# EAGLE design picaxe28x1bb (EAGLE 7.1.0)
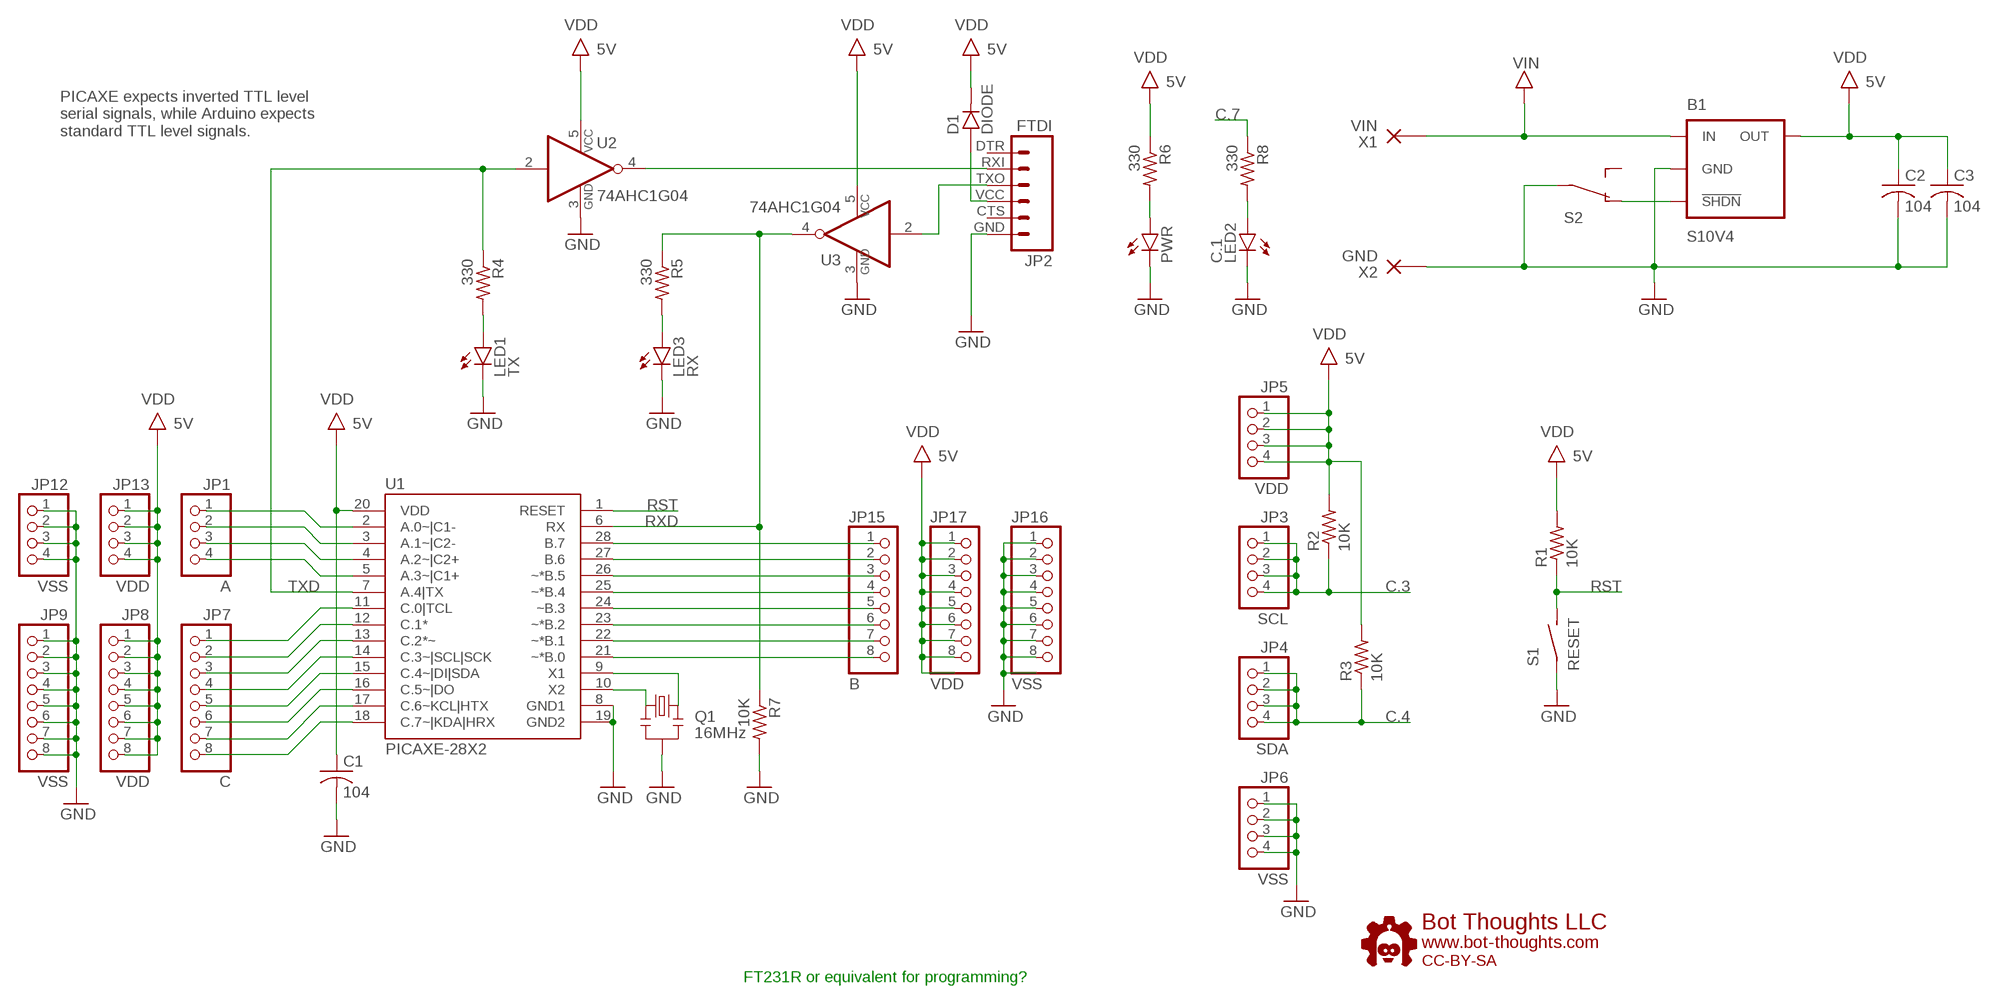
[diagram p0: schematic, sheet 1]

## Parts
B1  S10V4  POLOLU-S10V4  [POLOLU-S10V4]
C1  104  C-USC0603  [C0603]
C2  104  C-USC0603  [C0603]
C3  104  C-USC0603  [C0603]
D1  DIODE  DIODE_SOD123FL  [SOD123FL]
JP1  A  PINHD-1X04_2.54-S  [1X04-S]
JP2  FTDI  FTDI_BASICPTH  [FTDI_BASIC]
JP3  SCL  PINHD-1X04_2.54-S  [1X04-S]
JP4  SDA  PINHD-1X04_2.54-S  [1X04-S]
JP5  VDD  PINHD-1X04_2.54-S  [1X04-S]
JP6  VSS  PINHD-1X04_2.54-S  [1X04-S]
JP7  C  PINHD-1X08_2.54-S  [1X08-S]
JP8  VDD  PINHD-1X08_2.54-S  [1X08-S]
JP9  VSS  PINHD-1X08_2.54-S  [1X08-S]
JP12  VSS  PINHD-1X04_2.54-S  [1X04-S]
JP13  VDD  PINHD-1X04_2.54-S  [1X04-S]
JP15  B  PINHD-1X08_2.54-S  [1X08-S]
JP16  VSS  PINHD-1X08_2.54-S  [1X08-S]
JP17  VDD  PINHD-1X08_2.54-S  [1X08-S]
LED1  TX  LEDCHIPLED_0805  [CHIPLED_0805]
LED2  C.1  LEDCHIPLED_0805  [CHIPLED_0805]
LED3  RX  LEDCHIPLED_0805  [CHIPLED_0805]
PWR  LEDCHIPLED_0805  [CHIPLED_0805]
Q1  16MHz  RESONATOR_CSTCE_V_C  [CSTCE_V_C]
R1  10K  R-US_R0603  [R0603]
R2  10K  R-US_R0603  [R0603]
R3  10K  R-US_R0603  [R0603]
R4  330  R-US_R0603  [R0603]
R5  330  R-US_R0603  [R0603]
R6  330  R-US_R0603  [R0603]
R7  10K  R-US_R0603  [R0603]
R8  330  R-US_R0603  [R0603]
S1  RESET  SPST_3X4X2  [3X4X2TACT]
S2  SPDT_OS102011MAQN1  [OS102011MA1Q]
U1  PICAXE-28X2  [DIL28-3]
U2  74AHC1G04  74AHC1G04DBV  [SOT23-5]
U3  74AHC1G04  74AHC1G04DBV  [SOT23-5]
U$10  BTLOGO-LOGO-MD  [BTLOGOM]
X1  VIN  WIREPAD_18GA  [PAD_18GA]
X2  GND  WIREPAD_18GA  [PAD_18GA]

## Nets
A.0: JP1.1 U1.2(A.0~|C1-)
A.1: JP1.2 U1.3(A.1~|C2-)
A.2: JP1.3 U1.4(A.2~|C2+)
A.3: JP1.4 U1.5(A.3~|C1+)
B.0: JP15.8 U1.21(~*B.0)
B.1: JP15.7 U1.22(~*B.1)
B.2: JP15.6 U1.23(~*B.2)
B.3: JP15.5 U1.24(~B.3)
B.4: JP15.4 U1.25(~*B.4)
B.5: JP15.3 U1.26(~*B.5)
B.6: JP15.2 U1.27(B.6)
B.7: JP15.1 U1.28(B.7)
C.0: JP7.1 U1.11(C.0|TCL)
C.1: JP7.2 U1.12(C.1*)
C.2: JP7.3 U1.13(C.2*~)
C.3: JP3.1 JP3.2 JP3.3 JP3.4 JP7.4 R2.1 U1.14(C.3~|SCL|SCK)
C.4: JP4.1 JP4.2 JP4.3 JP4.4 JP7.5 R3.1 U1.15(C.4~|DI|SDA)
C.5: JP7.6 U1.16(C.5~|DO)
C.6: JP7.7 U1.17(C.6~KCL|HTX)
C.7: JP7.8 R8.1 U1.18(C.7~|KDA|HRX)
EN: B1.!SHDN S2.P$1(O1)
GND: B1.GND C1.2 C2.2 C3.2 JP2.GND JP6.1 JP6.2 JP6.3 JP6.4 JP9.1 JP9.2 JP9.3 JP9.4 JP9.5 JP9.6 JP9.7 JP9.8 JP12.1 JP12.2 JP12.3 JP12.4 JP16.1 JP16.2 JP16.3 JP16.4 JP16.5 JP16.6 JP16.7 JP16.8 LED1.C LED2.C LED3.C PWR.C Q1.GND R7.2 S1.P$1(P) S2.P$2(P) U1.8(GND1) U1.19(GND2) U2.3(GND) U3.3(GND) X2.P$1(P)
N$1: LED2.A R8.2
N$2: PWR.A R6.2
N$3: D1.A JP2.VCC
N$5: LED1.A R4.2
N$7: LED3.A R5.2
N$15: Q1.X2 U1.10(X2)
N$16: Q1.X1 U1.9(X1)
RST: R1.1 S1.P$2(S) U1.1(RESET)
RXD: R5.1 R7.1 U1.6(RX) U3.4(O)
RXI: JP2.RXI U2.4(O)
TXD: R4.1 U1.7(A.4|TX) U2.2(I)
TXO: JP2.TXO U3.2(I)
VDD: B1.VOUT(OUT) C1.1 C2.1 C3.1 D1.C JP5.1 JP5.2 JP5.3 JP5.4 JP8.1 JP8.2 JP8.3 JP8.4 JP8.5 JP8.6 JP8.7 JP8.8 JP13.1 JP13.2 JP13.3 JP13.4 JP17.1 JP17.2 JP17.3 JP17.4 JP17.5 JP17.6 JP17.7 JP17.8 R1.2 R2.2 R3.2 R6.1 U1.20(VDD) U2.5(VCC) U3.5(VCC) ; supply symbol labelled 5V
VIN: B1.VIN(IN) X1.P$1(P)
Unconnected: JP2.CTS JP2.DTR S2.P$3(O2)

## Notes on the sheet
- PICAXE expects inverted TTL level
  serial signals, while Arduino expects
  standard TTL level signals.
- FT231R or equivalent for programming?

## Library data of the parts
B1 = bt_regulator:POLOLU-S10V4: Pololu 5V Step-up, Step-down Switching Regulator This switching regulator uses the SEPIC topology to produce 5 V from input voltages between 2.5 V and 18 V. The wide input range coupled with its ability to convert both higher and lower input voltages makes it useful for applications where the power supply voltage can vary greatly, as with batteries that start above but discharge below 5 V. The compact (0.4″ × 0.575″) module can supply over 400 mA in typical applications. product link <https://www.pololu.com/product/2121>
C1-C3 = rcl:C-US: CAPACITOR, American symbol
D1 = bt_diode:DIODE: Diode Collection of generic diodes in various packages
JP1 JP3-JP6 JP12 JP13 = pinhead-2:PINHD-1X04: PIN HEADER
JP2 = SparkFun-Connectors:FTDI_BASIC: FTDI Basic header with labels
JP7-JP9 JP15-JP17 = pinhead-2:PINHD-1X08: PIN HEADER
LED1-LED3 PWR = bt_opto:LED: LED Various packages
Q1 = bt_crystal:RESONATOR: Crystal Resonator, 3-pin
R1-R8 = resistor:R-US_: RESISTOR, American symbol
S1 = bt_electromech:SPST: SPST SWITCH
S2 = bt_electromech:SPDT: MARQUARDT SWITCH
U1 = bt_pic:PICAXE-28X2: PICAXE 28 pin BASIC microcontroller chip PICAXE is a neat entry-level microcontroller system that is relatively cheap to get started with. The chip is programmed with a simple serial connection and the BASIC development environment is free! PICAXE has some excellent educational applications and support, and is a great entryway into more complicated embedded systems. If you’re look for a place to start with microcontrollers, PICAXE is a great way to go! datasheet.pdf <http://www.rev-ed.co.uk/docs/picaxe_manual1.pdf>
U2 U3 = 74xx-little-us:74*1G04: INVERTER Gate
U$10 = bt:BTLOGO: Bot Thoughts Logo
X1 X2 = bt_electromech:WIREPAD: PIN PAD (PINPAD) Generic pin pad connector

## Board
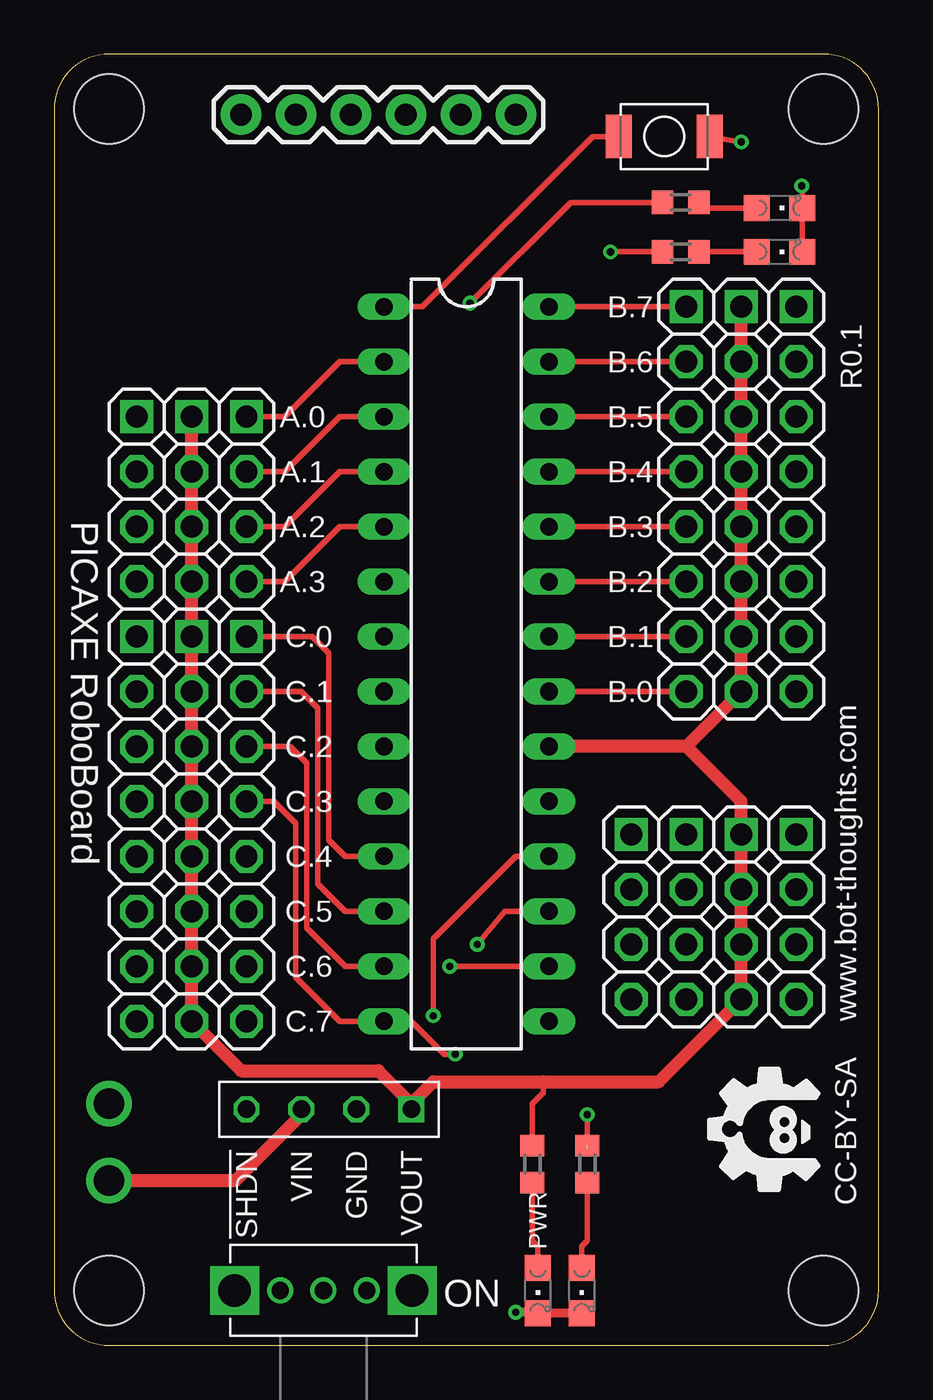
[diagram p1: board, top side]
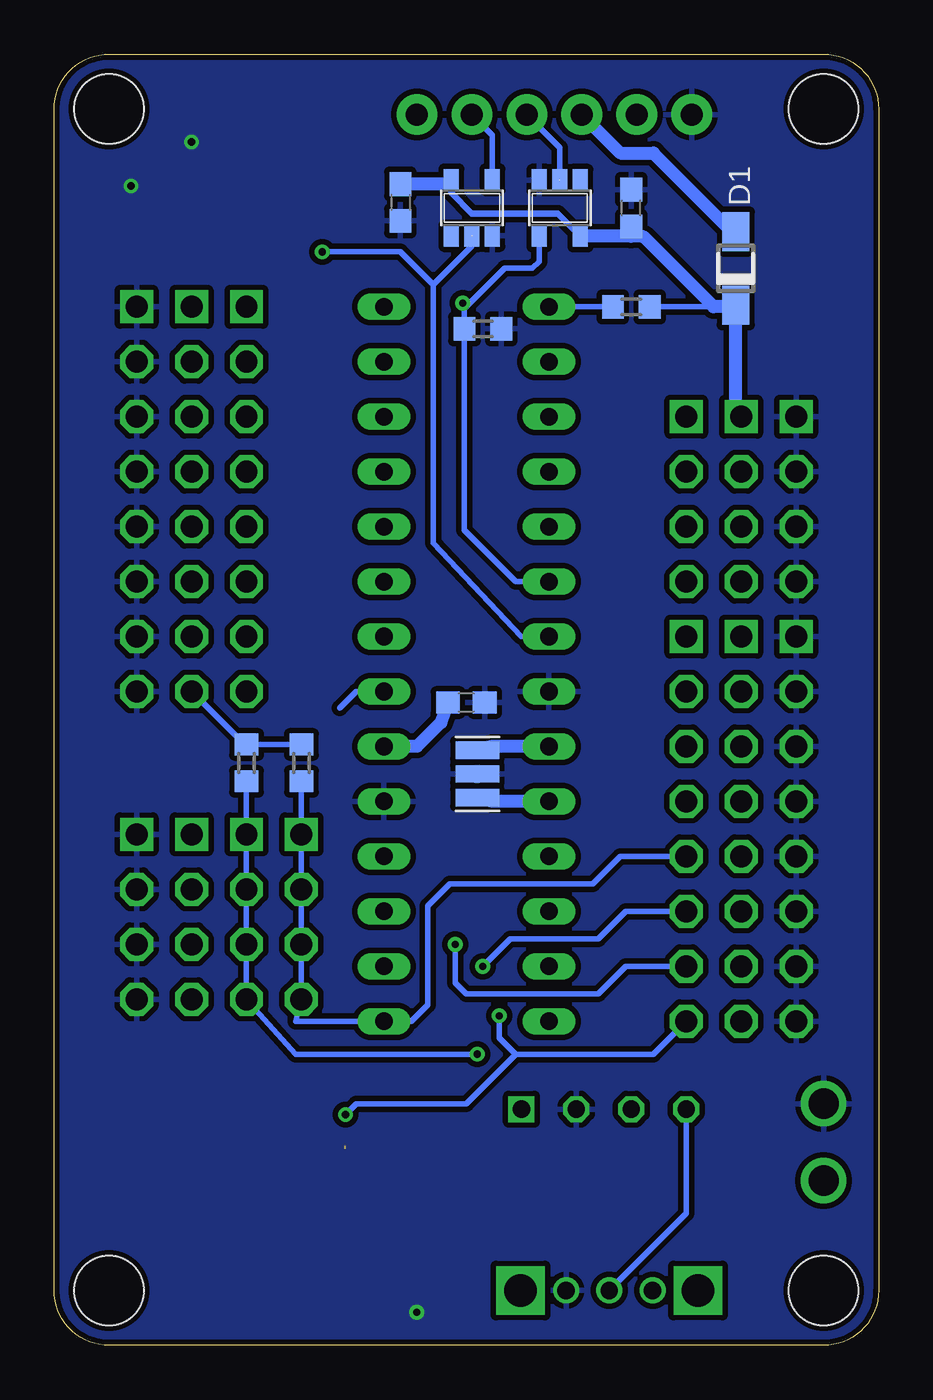
[diagram p2: board, bottom side, seen from below]

Size 38.1 x 59.69 mm. Coordinates in mm from the lower left corner, seen from the top.
Outline: 35.56,59.69 2.54,59.69 arc90 0,57.15 0,2.54 arc90 2.54,0 35.56,0 arc90 38.1,2.54 38.1,57.15 arc90 35.56,59.69
Copper layers (1*16): Top 0.0356mm / dielectric 1.5011mm / Bottom 0.0356mm
Design rules "LaenPCBOrder": minimum track width 6mil, minimum drill 13mil, track to track 10mil, track to pad 10mil, pad to pad 10mil, via to via 10mil, smd to smd 8mil, copper to edge 10mil, drill to drill 10mil, minimum pad ring 7mil, minimum via ring 7mil, stop-mask expansion 3mil, vias tented up to drill 20mil, thermal gap 10mil
Holes 3.2 mm at 2.54,57.15 35.56,57.15 35.56,2.54 2.54,2.54

### Footprints (pad centres in the part's own frame; a part is rotated, then mirrored left to right if it is on the bottom)
POLOLU-S10V4 = drill 0.8 octagon: !SHDN 3.81,0; GND -1.27,0; VIN 1.27,0 | drill 0.8 square: VOUT -3.81,0
C0603 = smd 1.1 x 1: 1 -0.85,0; 2 0.85,0
SOD123FL = smd 1.8 x 1.25: A 1.7,0; C -1.7,0
1X04-S = drill 1.016 square: 1 -3.81,0 | drill 1.016 octagon: 2 -1.27,0; 3 1.27,0; 4 3.81,0
FTDI_BASIC = drill 1.016 pad 1.88: CTS 10.16,0; DTR 0,0; GND 12.7,0; RXI 2.54,0; TXO 5.08,0; VCC 7.62,0
1X08-S = drill 1.016 square: 1 -8.89,0 | drill 1.016 octagon: 2 -6.35,0; 3 -3.81,0; 4 -1.27,0; 5 1.27,0; 6 3.81,0; 7 6.35,0; 8 8.89,0
CHIPLED_0805 = smd 1.2 x 1.2: A 0,-1.05; C 0,1.05
CSTCE_V_C = smd 0.8 x 2: GND 0,0; X1 -1.1,0; X2 1.1,0
R0603 = smd 1 x 1.1: 1 -0.85,0; 2 0.85,0
3X4X2TACT = smd 1.2 x 2: P$1 -2.1,0; P$2 2.1,0
OS102011MA1Q = drill 1.5 square: G1 -4.1,0; G2 4.1,0 | drill 0.8: P$1 0,0; P$2 2,0; P$3 -2,0
DIL28-3 = drill 0.813 long: 1 -16.51,-3.81; 2 -13.97,-3.81; 3 -11.43,-3.81; 4 -8.89,-3.81; 5 -6.35,-3.81; 6 -3.81,-3.81; 7 -1.27,-3.81; 8 1.27,-3.81; 9 3.81,-3.81; 10 6.35,-3.81; 11 8.89,-3.81; 12 11.43,-3.81; 13 13.97,-3.81; 14 16.51,-3.81; 15 16.51,3.81; 16 13.97,3.81; 17 11.43,3.81; 18 8.89,3.81; 19 6.35,3.81; 20 3.81,3.81; 21 1.27,3.81; 22 -1.27,3.81; 23 -3.81,3.81; 24 -6.35,3.81; 25 -8.89,3.81; 26 -11.43,3.81; 27 -13.97,3.81; 28 -16.51,3.81
SOT23-5 = smd 0.69 x 0.99: 1 -0.95,-1.29; 2 0,-1.29; 3 0.95,-1.29; 4 0.95,1.3; 5 -0.95,1.3
PAD_18GA = drill 1.4: P$1 0,0

### Placement (x,y rotation side)
B1  12.7,10.92 180 top
C1  19.05,29.72 0 bottom
C2  22.1,52.83 270 bottom
C3  11.43,52.58 90 bottom
D1  6.6,49.78 90 bottom
JP1  8.89,39.12 270 top
JP2  21.34,56.9 180 top
JP3  29.21,19.81 270 top
JP4  26.67,19.81 270 top
JP5  31.75,19.81 270 top
JP6  34.29,19.81 270 top
JP7  8.89,23.88 270 top
JP8  6.35,23.88 270 top
JP9  3.81,23.88 270 top
JP12  3.81,39.12 270 top
JP13  6.35,39.12 270 top
JP15  29.21,39.12 270 top
JP16  34.29,39.12 270 top
JP17  31.75,39.12 270 top
LED1  33.53,50.55 270 top
LED2  24.38,2.54 180 top
LED3  33.53,52.58 270 top
PWR  22.35,2.54 180 top
Q1  18.54,26.42 270 bottom
R1  11.43,48.01 0 bottom
R2  29.21,26.92 90 bottom
R3  26.67,26.92 90 bottom
R4  28.96,50.55 0 top
R5  28.96,52.83 0 top
R6  22.1,8.38 270 top
R7  18.29,46.99 0 bottom
R8  24.64,8.38 270 top
S1  28.19,55.88 180 top
S2  12.45,2.54 0 top
U1  19.05,31.5 270 top
U2  18.8,52.58 0 bottom
U3  14.73,52.58 180 bottom
U$10  35.56,9.91 90 top
X1  2.54,7.62 0 top
X2  2.54,11.18 0 top

### Tracks (layer width: path | path; a pad name or v marks a point on that pad's centre or on a via)
A.0
  Top 0.254: U1.2 13.21,45.47 10.67,42.93 JP1.1
A.1
  Top 0.254: U1.3 13.21,42.93 10.67,40.39 JP1.2
A.2
  Top 0.254: U1.4 13.21,40.39 10.67,37.85 JP1.3
A.3
  Top 0.254: U1.5 13.21,37.85 10.67,35.31 JP1.4
B.0
  Top 0.254: JP15.8 U1.21
  Bottom 0.254: U1.21 24.13,30.23 24.89,29.46
B.1
  Top 0.254: JP15.7 U1.22
B.2
  Top 0.254: JP15.6 U1.23
B.3
  Top 0.254: JP15.5 U1.24
B.4
  Top 0.254: JP15.4 U1.25
B.5
  Top 0.254: JP15.3 U1.26
B.6
  Top 0.254: JP15.2 U1.27
B.7
  Top 0.254: JP15.1 U1.28
C.0
  Top 0.254: JP7.1 11.94,32.77 12.7,32 12.7,23.37 13.46,22.61 U1.11
C.1
  Top 0.254: JP7.2 11.43,30.23 12.19,29.46 12.19,21.34 13.46,20.07 U1.12
C.2
  Top 0.254: JP7.3 10.92,27.69 11.68,26.92 11.68,19.3 13.46,17.53 U1.13
C.3  (via drill 0.33)
  Top 0.254: JP7.4 10.16,25.15 11.18,24.13 11.18,17.02 13.21,14.99 U1.14 16.51,14.99 18.03,13.46 v18.54,13.46
  Bottom 0.254: R2.1 JP3.1 JP3.2 JP3.3 JP3.4 26.92,13.46 v18.54,13.46
C.4
  Bottom 0.254: JP7.5 11.94,22.61 13.21,21.34 19.81,21.34 20.83,20.32 20.83,15.75 21.59,14.99 U1.15 26.92,14.99 JP4.4 JP4.3 JP4.2 JP4.1 R3.1
C.5  (via drill 0.33)
  Top 0.254: v18.29,17.53 U1.16
  Bottom 0.254: JP7.6 11.68,20.07 12.95,18.8 17.02,18.8 v18.29,17.53
C.6  (via drill 0.33)
  Top 0.254: v19.56,18.54 20.83,20.07 U1.17
  Bottom 0.254: JP7.7 11.68,17.53 12.95,16.26 19.05,16.26 19.56,16.76 v19.56,18.54
C.7  (via drill 0.33)  (1 unrouted)
  Top 0.254: U1.18 21.34,22.61 17.53,18.8 v17.53,15.24 | v24.64,10.67 24.64,9.09
  Bottom 0.254: v17.53,15.24 17.53,14.22 16.76,13.46 | 16.76,13.46 10.41,13.46 JP7.8 | 16.76,13.46 19.05,11.18 24.13,11.18 v24.64,10.67
EN
  Bottom 0.254: S2.P$1 8.89,6.1 B1.!SHDN
GND  (via drill 0.33)
  Top 0.254: S1.P$1 v31.75,55.63 | LED1.C LED3.C 34.58,53.56 v34.54,53.59
  Top 0.406: LED2.C PWR.C 22.07,1.52 v21.34,1.52
  pour Bottom: 0,2.54 0,57.15 arc-90 2.54,59.69 35.56,59.69 arc-90 38.1,57.15 38.1,2.54 arc-90 35.56,0 2.54,0 arc-90
N$1
  Top 0.254: LED2.A 24.38,4.57 24.64,4.83 R8.2
N$2
  Top 0.254: R6.2 22.1,4.83 22.35,4.57 PWR.A
N$3
  Bottom 0.61: JP2.VCC 11.94,55.12 10.41,55.12 6.78,51.48 D1.A
N$5
  Top 0.254: LED1.A R4.2
N$7
  Top 0.254: LED3.A 30.06,52.58 R5.2
N$15
  Bottom 0.61: U1.10 17.86,25.15 Q1.X2
N$16
  Bottom 0.61: U1.9 17.86,27.69 Q1.X1
RST
  Top 0.254: S1.P$2 24.89,55.88 17.02,48.01 U1.1
  Bottom 0.254: U1.1 R1.1
RXD  (via drill 0.33)
  Top 0.254: v19.22,48.17 23.88,52.83 R5.1
  Bottom 0.254: U3.4 15.68,50.1 16,49.78 17.27,49.78 19.14,47.92 | U1.6 16.76,35.31 19.14,37.68 R7.1 19.14,47.92 | v19.22,48.17 19.14,47.92
RXI
  Bottom 0.254: JP2.RXI 17.85,55.95 U2.4
TXD  (via drill 0.33)
  Top 0.254: v25.71,50.55 R4.1
  Bottom 0.254: 20.57,49.02 18.8,50.8 U2.2 | 20.57,49.02 20.57,37.08 16.51,32.77 U1.7 | 20.57,49.02 22.1,50.55 v25.71,50.55
TXO
  Bottom 0.254: JP2.TXO 14.73,55.37 U3.2
VDD
  Top 0.254: R6.1 22.1,11.18 22.61,11.68 22.61,12.19
  Top 0.61: JP13.1 JP13.2 JP13.3 JP13.4 JP8.1 JP8.2 JP8.3 JP8.4 JP8.5 JP8.6 JP8.7 JP8.8 8.64,12.7 14.99,12.7 16.51,11.18 | 29.21,27.69 JP17.8 JP17.7 JP17.6 JP17.5 JP17.4 JP17.3 JP17.2 JP17.1 | 29.21,27.69 U1.20 | 29.21,27.69 31.75,25.15 JP5.1 JP5.2 JP5.3 JP5.4 27.94,12.19 22.61,12.19 17.53,12.19 16.51,11.18 | 16.51,11.18 B1.VOUT
  Bottom 0.254: R3.2 R2.2 29.3,27.77 JP17.8 | C3.1 11.43,51.26 | R1.2 7.62,48.01
  Bottom 0.305: U3.5 14.83,52.32 18.8,52.32 19.75,53.27 U2.5
  Bottom 0.61: C1.1 20.23,28.79 21.34,27.69 U1.20 | JP13.1 6.6,43.18 D1.C 6.68,48.01 7.62,48.01 10.86,51.24 11.43,51.26 U3.5 | U2.5 19.8,53.68 C2.1
VIN
  Top 0.61: X1.P$1 8.38,7.62 11.43,10.67 B1.VIN

### Text on the board
tNames: B.7 | B.6 | R0.1 | A.0 | B.5 | A.1 | B.4 | PICAXE RoboBoard | A.2 | B.3 | A.3 | B.2 | C.0 | B.1 | C.1 | B.0 | C.2 | C.3 | C.4 | C.5 | C.6 | www.bot-thoughts.com | C.7 | CC-BY-SA | ON